# Altium schematic sheet horus_psu.SchDoc
size A4
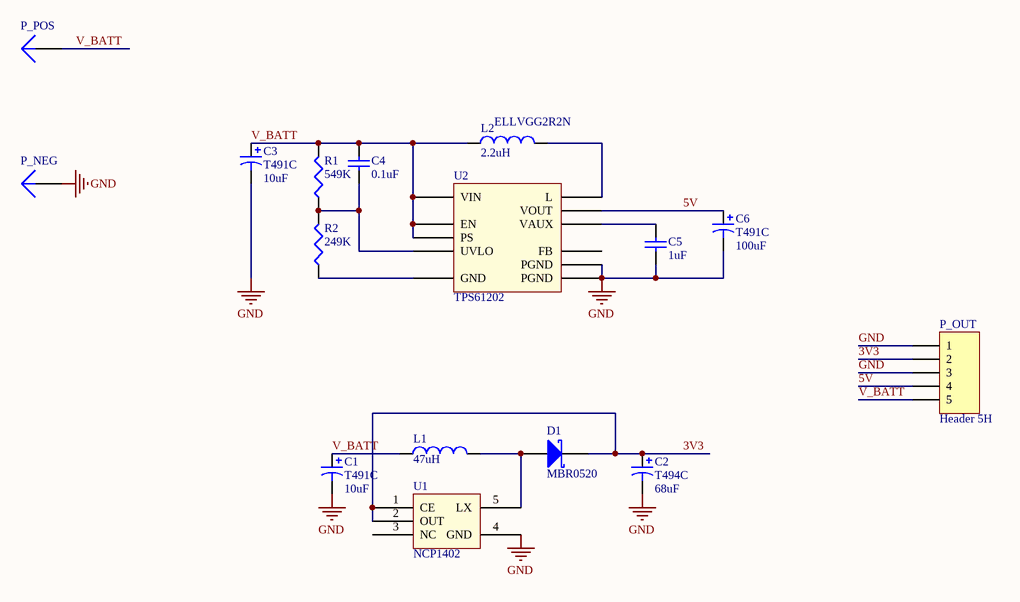
[diagram p0: horus_psu.SchDoc]

## Parts
C1  T491C  value 10uF  [C]
C2  T494C  value 68uF  [C]
C3  T491C  value 10uF  [C]
C4  value 0.1uF  [1608[0603]]  (hidden comment: Cap Semi)
C5  value 1uF  [1608[0603]]  (hidden comment: Cap Semi)
C6  T491C  value 100uF  [C]
D1  MBR0520  [SOD-123]
L1  value 47uH  [POWER-CHOKE_47uH]  (hidden comment: Inductor)
L2  ELLVGG2R2N  value 2.2uH  [ELLVGG]
P_NEG  Plug  [PIN1]  (value not drawn)
P_OUT  Header 5H  [HDR1X5H]
P_POS  Plug  [PIN1]  (value not drawn)
R1  value 549K  [J1-0603]  (hidden comment: Res3)
R2  value 249K  [J1-0603]  (hidden comment: Res3)
U1  NCP1402  [SOT95P280X100-5N]
U2  TPS61202  [TPS61200]

## Nets
GND: C1.2 C2.2 C3.2 C5.1 C6.2 P_NEG.1 P_OUT.1 P_OUT.3 U1.4(GND) U2.0(PGND) U2.4(PGND)
3V3: C2.1 D1.1(K) P_OUT.2 U1.1(CE) U1.2(OUT)
5V: C6.1 P_OUT.4 U2.2(VOUT)
V_BATT: C1.1 C3.1 C4.2 L1.1 L2.1 P_OUT.5 P_POS.1 R1.2 U2.5(VIN) U2.6(EN) U2.8(PS)
NetC4_1: C4.1 R1.1 R2.2 U2.7(UVLO)
NetC5_2: C5.2 U2.1(VAUX)
NetD1_2: D1.2(A) L1.2 U1.5(LX)
NetL2_2: L2.2 U2.3(L)
NetR2_1: R2.1 U2.9(GND)

Not connected (* = marked no-connect by the designer): U1 3(NC); U2 10(FB)

## Library data of the parts
C1 C3 C6 = T491C: Solid Tantalum Chip Capacitor, Standard T491 Series - Industrial Grade; Published: 17-Jul-2002; LatestRevisionDate: 19-Mar-2004; LatestRevisionNote: Silkscreen dimensions re-sized.; DatasheetDocument: Mar-2001; PackageDocument: Mar-2001; PackageReference: C; Publisher: Altium Limited; Code_JEITA: 6032-28; ComponentLink1Description: Manufacturer Link; ComponentLink1URL: http://www.kemet.com/; ComponentLink2Description: Datasheet; ComponentLink2URL: http://www.kemet.com/kemet/web/homepage/kechome.nsf/vapubfilesname/F3102TA.pdf/$file/F3102TA.pdf
C2 = T494C: Solid Tantalum Chip Capacitor, Standard T494 Series - Low ESR, Industrial Grade; Published: 17-Jul-2002; LatestRevisionDate: 19-Mar-2004; LatestRevisionNote: Silkscreen dimensions re-sized.; DatasheetDocument: Mar-2001; PackageDocument: Mar-2001; PackageReference: C; Publisher: Altium Limited; Code_JEITA: 6032-28; ComponentLink1Description: Manufacturer Link; ComponentLink1URL: http://www.kemet.com/; ComponentLink2Description: Datasheet; ComponentLink2URL: http://www.kemet.com/kemet/web/homepage/kechome.nsf/vapubfilesname/F3102TA.pdf/$file/F3102TA.pdf
C4 C5 = Cap Semi: Capacitor (Semiconductor SIM Model); Published: 8-Jun-2000; LatestRevisionDate: 29-May-2009; LatestRevisionNote: IPC-7351 Footprint Added.; PackageReference: C1206; Publisher: Altium Limited; PackageDescription: Chip Capacitor
D1 = Diode BAS70: Silicon AF Schottky Diode for High-Speed Switching; pin to pad: 3>2; Note: Pin 2 is not connected and not drawn.; Published: 21-Mar-2003; LatestRevisionDate: 29-May-2009; LatestRevisionNote: IPC-7351 Footprint Added.; DatasheetVersion: Oct-1999; PackageVersion: Sep-2001; PackageReference: SOT-23; Publisher: Altium Limited; PackageDescription: 3-Pin SOT-23 Package 0.95 mm Pitch, 2.5 mm Lead Span; ComponentLink1Description: Manufacturer Link; ComponentLink1URL: http://www.infineon.com/; ComponentLink2Description: Datasheet; ComponentLink2URL: http://www.infineon.com/upload/Document/cmc_upload/documents/009/382/bas40_bas140series_1.pdf
L1 L2 = Inductor: Code_IEC: 1005; Published: 8-Jun-2000; LatestRevisionDate: 29-May-2009; LatestRevisionNote: IPC-7351 Footprint Added.; PackageReference: 0402-A; Publisher: Altium Limited; PackageDescription: Chip Inductor; Code_JEITA: 0402
P_OUT = Header 5H: Header, 5-Pin, Right Angle; LatestRevisionDate: 17-Jul-2002; LatestRevisionNote: Re-released for DXP Platform.; Publisher: Altium Limited
R1 R2 = Res3: Resistor; Published: 8-Jun-2000; LatestRevisionDate: 29-May-2009; LatestRevisionNote: IPC-7351 Footprint Added.; PackageReference: J1-0603; Publisher: Altium Limited; PackageDescription: Chip Resistor
U2 = TPS61200
P_NEG P_POS = Plug: LatestRevisionDate: 17-Jul-2002; LatestRevisionNote: Re-released for DXP Platform.; Publisher: Altium Limited